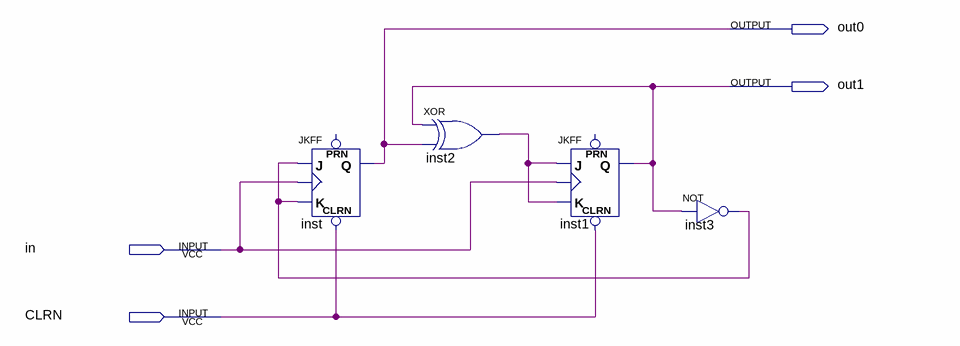
[diagram p0: schematic sheet]
// Quartus schematic 3SyncCounter.bdf as structural Verilog: 4 symbols, 4 pins
module \3SyncCounter  (
  input  in,
  input  CLRN,
  output out0,
  output out1
);

  wire inst2_out, inst3_out;

  JKFF inst (.CLRN(CLRN), .K(inst3_out), .J(inst3_out), .CLK(in), .Q(out0));  // open: PRN
  xor inst2 (inst2_out, out1, out0);
  JKFF inst1 (.CLRN(CLRN), .K(inst2_out), .J(inst2_out), .CLK(in), .Q(out1));  // open: PRN
  not inst3 (inst3_out, out1);
endmodule
